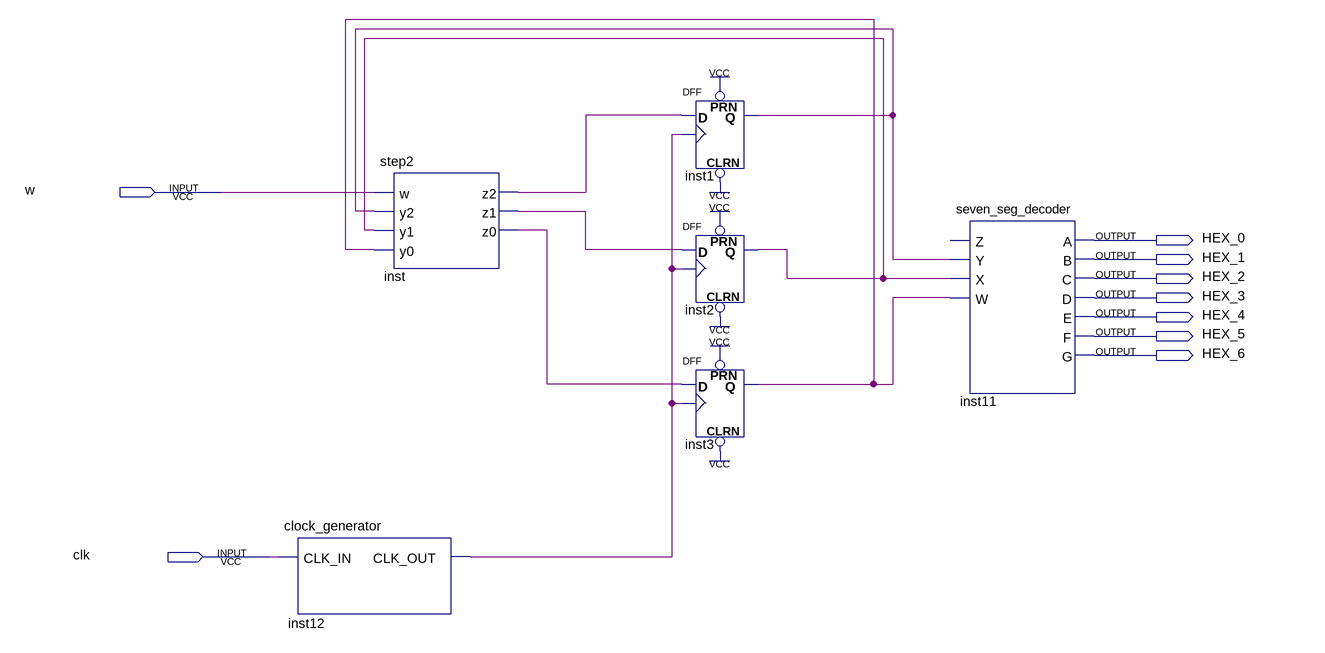
[diagram p0: schematic sheet]
// Quartus schematic lab11step2.bdf as structural Verilog: 6 symbols, 9 pins
module lab11step2 (
  input  w,
  input  clk,
  output HEX_0,
  output HEX_1,
  output HEX_2,
  output HEX_3,
  output HEX_4,
  output HEX_5,
  output HEX_6
);

  wire inst1_q, inst2_q, inst3_q, inst12_clk_out, inst_z0, inst_z1, inst_z2;

  clock_generator inst12 (.CLK_IN(clk), .CLK_OUT(inst12_clk_out));
  step2 inst (.w(w), .y2(inst1_q), .y1(inst2_q), .y0(inst3_q), .z2(inst_z2), .z1(inst_z1), .z0(inst_z0));
  DFF inst1 (.CLRN(1'b1), .CLK(inst12_clk_out), .D(inst_z2), .PRN(1'b1), .Q(inst1_q));
  DFF inst2 (.CLRN(1'b1), .CLK(inst12_clk_out), .D(inst_z1), .PRN(1'b1), .Q(inst2_q));
  DFF inst3 (.CLRN(1'b1), .CLK(inst12_clk_out), .D(inst_z0), .PRN(1'b1), .Q(inst3_q));
  seven_seg_decoder inst11 (
    .Y(inst1_q), .X(inst2_q), .W(inst3_q), .A(HEX_0), .B(HEX_1), .C(HEX_2), .D(HEX_3), .E(HEX_4), .F(HEX_5),
    .G(HEX_6));  // open: Z
endmodule
